# EAGLE board NHK2016mother (EAGLE 6.2)
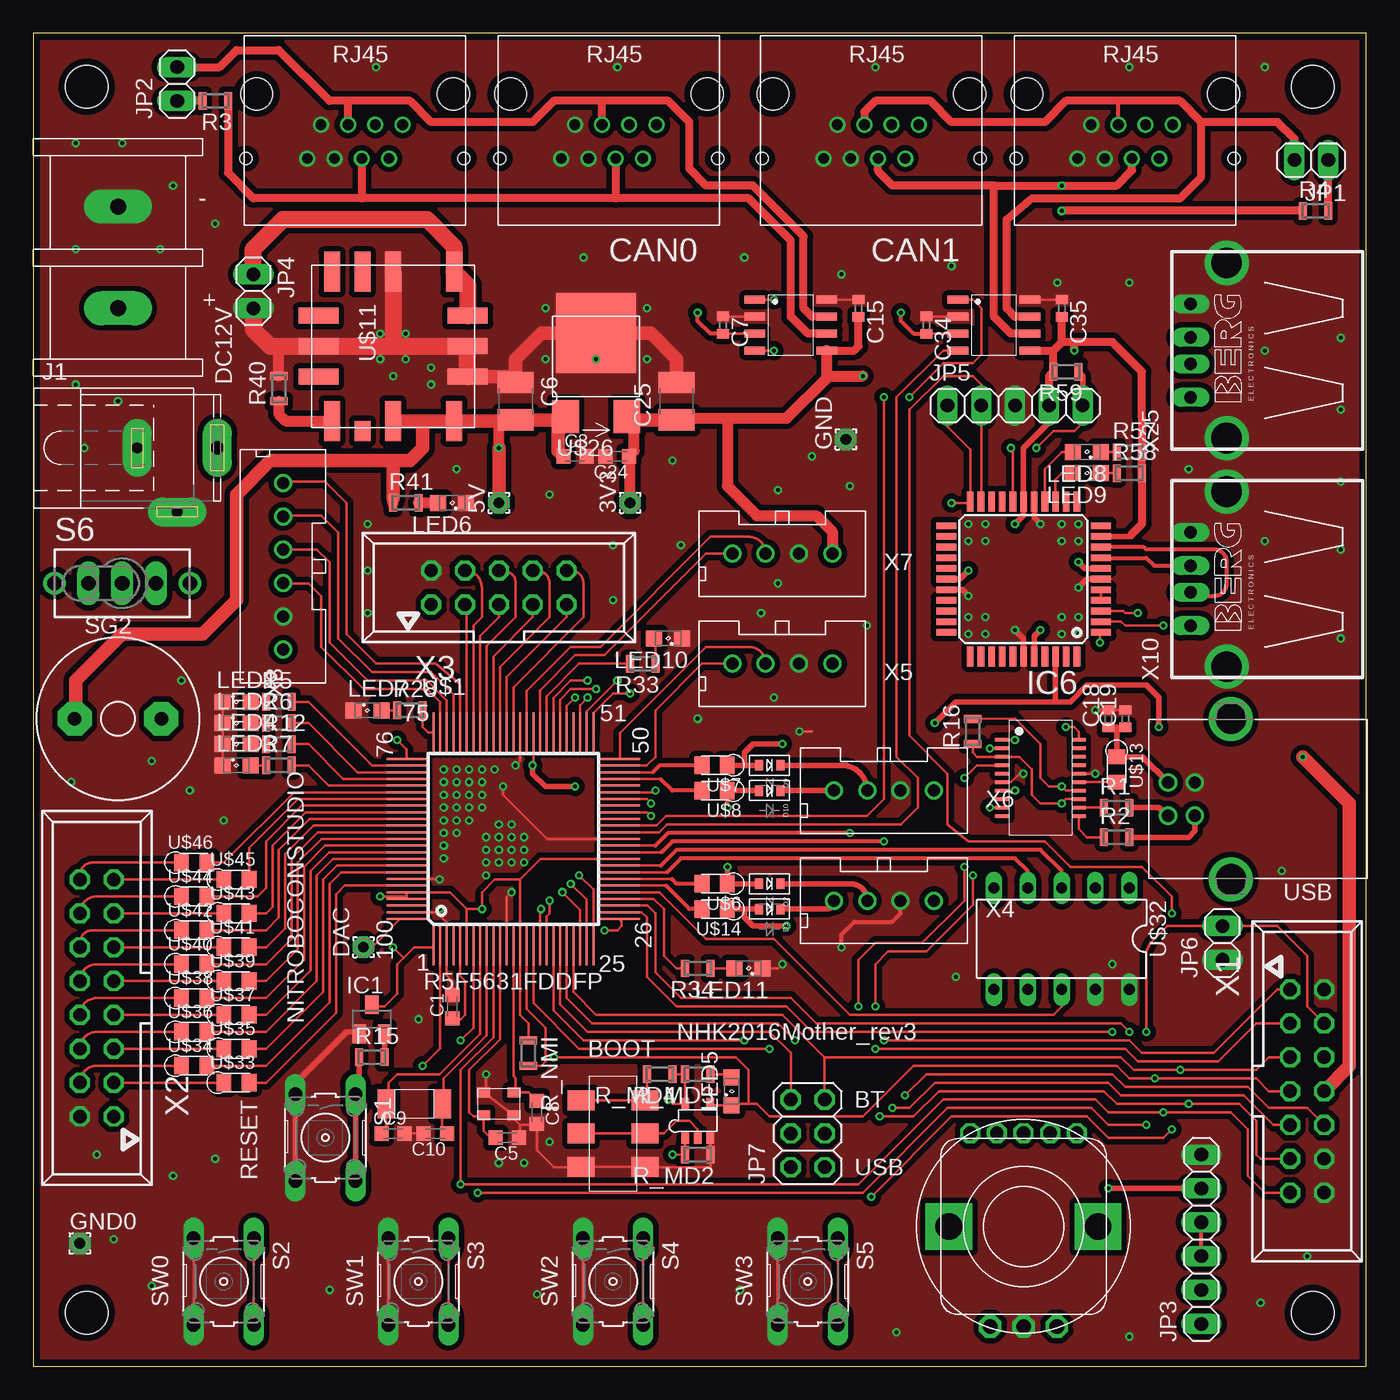
[diagram p1: board, top side]
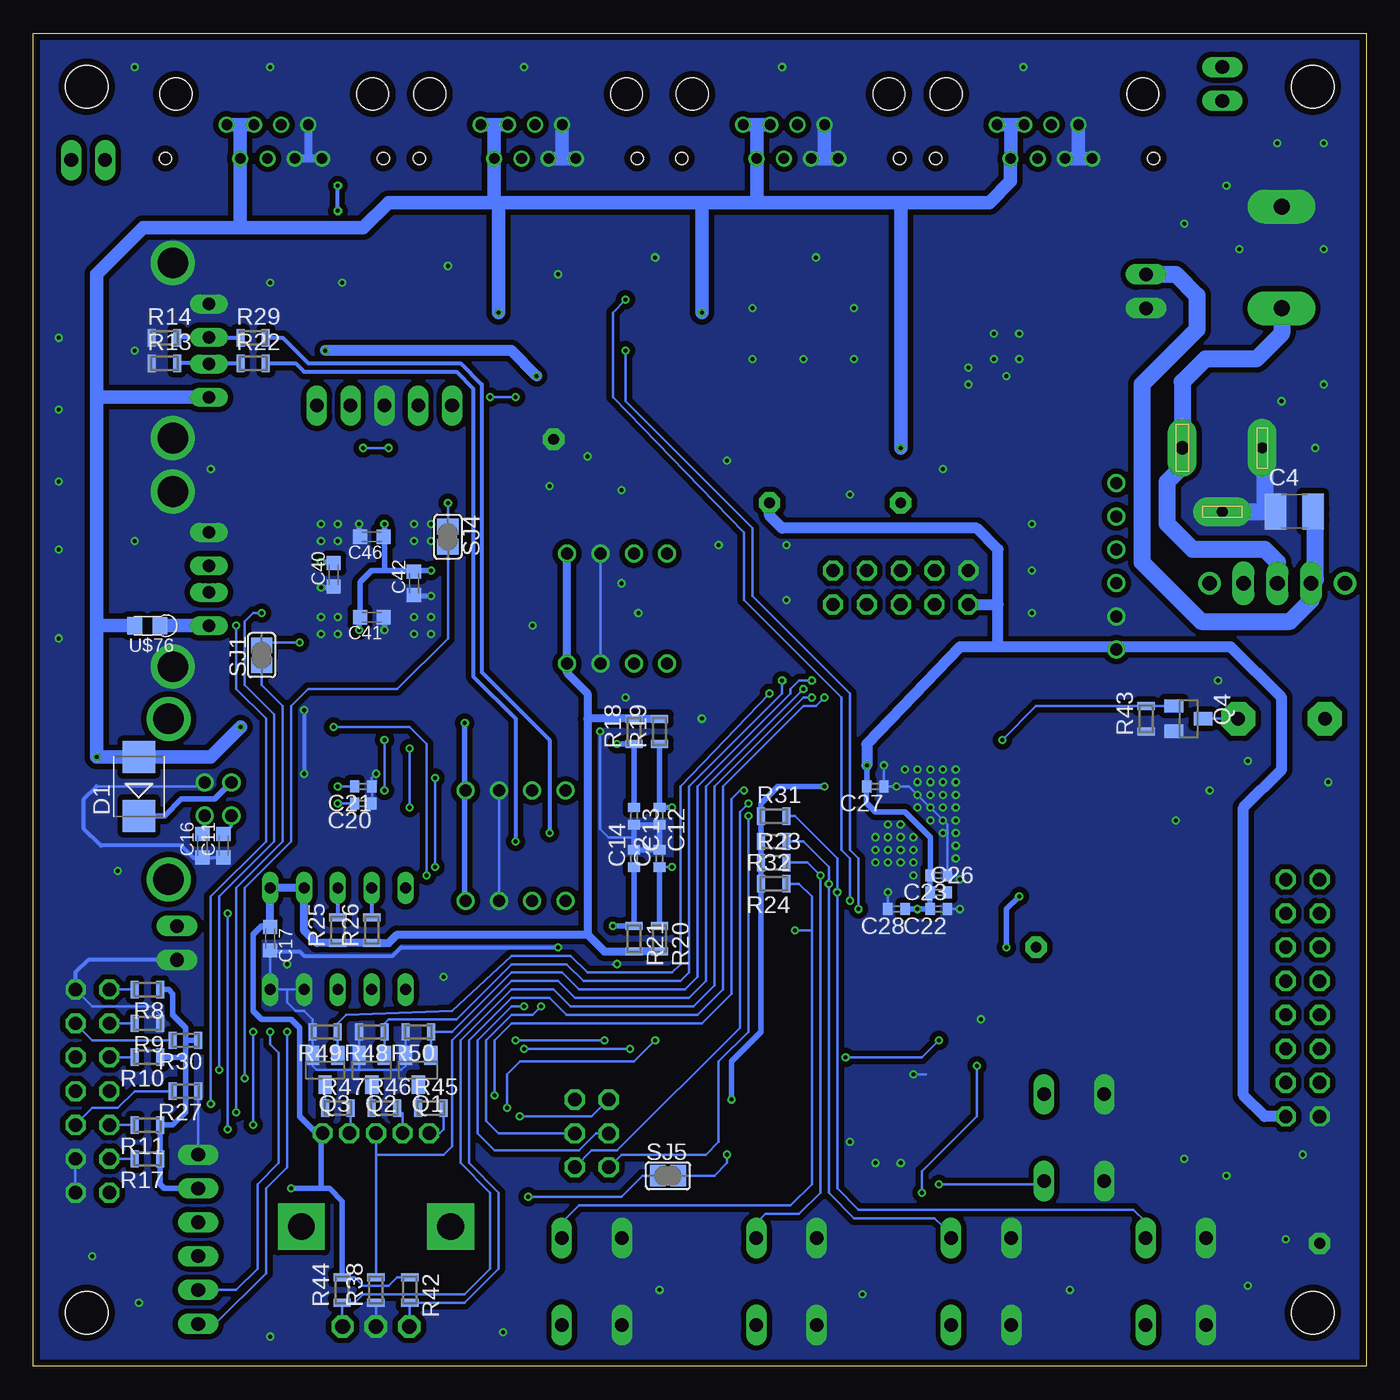
[diagram p2: board, bottom side, seen from below]

Size 100 x 100 mm. Coordinates in mm from the lower left corner, seen from the top.
Outline: 0,0 100,0 100,100 0,100 0,0
Copper layers (1*16): Top 0.035mm / dielectric 1.6mm / Bottom 0.035mm
Design rules "default": minimum track width 6mil, minimum drill 12mil, track to track 6mil, track to pad 6mil, pad to pad 6mil, via to via 8mil, smd to smd 0mil, copper to edge 20mil, drill to drill 10mil, minimum pad ring 6mil, minimum via ring 6mil, stop-mask expansion 0mil, vias tented up to drill 100mil, thermal gap 10mil
Holes 3.2 mm at 4,96 96,96 4,4 96,4

## Footprints (pad centres in the part's own frame; a part is rotated, then mirrored left to right if it is on the bottom)
1,6/0,8 = drill 0.813 pad 1.6 octagon: 1 0,0
C0603K = smd 1.05 x 1.08: 1 -0.875,0; 2 0.875,0
C0402 = smd 0.7 x 0.9: 1 -0.65,0; 2 0.65,0
C3225 = smd 1.6 x 2.7: 1 -1.4,0; 2 1.4,0
SMB = smd 2.4 x 2.4: A 2.2,0; C -2.2,0
SOD-523 = smd 0.8 x 0.6: A 0,-0.8; K 0,0.8
SOT23B-3 = smd 1 x 1.4: 1 -0.95,-1.1; 2 0.95,-1.1; 3 0,1.1
TQFP44 = smd 1.5 x 0.5: 1 -5.8,4; 2 -5.8,3.2; 3 -5.8,2.4; 4 -5.8,1.6; 5 -5.8,0.8; 6 -5.8,0; 7 -5.8,-0.8; 8 -5.8,-1.6; 9 -5.8,-2.4; 10 -5.8,-3.2; 11 -5.8,-4; 23 5.8,-4; 24 5.8,-3.2; 25 5.8,-2.4; 26 5.8,-1.6; 27 5.8,-0.8; 28 5.8,0; 29 5.8,0.8; 30 5.8,1.6; 31 5.8,2.4; 32 5.8,3.2; 33 5.8,4 | smd 0.5 x 1.5: 12 -4,-5.8; 13 -3.2,-5.8; 14 -2.4,-5.8; 15 -1.6,-5.8; 16 -0.8,-5.8; 17 0,-5.8; 18 0.8,-5.8; 19 1.6,-5.8; 20 2.4,-5.8; 21 3.2,-5.8; 22 4,-5.8; 34 4,5.8; 35 3.2,5.8; 36 2.4,5.8; 37 1.6,5.8; 38 0.8,5.8; 39 0,5.8; 40 -0.8,5.8; 41 -1.6,5.8; 42 -2.4,5.8; 43 -3.2,5.8; 44 -4,5.8
SPC4078 = drill 0.8 pad 2.184 long: 1 -3,0; 2 0,-4.8 | drill 1 pad 2.184 long: 3 3,0
1X02 = drill 1.016 long: 1 -1.27,0; 2 1.27,0
1X06 = drill 1.016 long: 1 -6.35,0; 2 -3.81,0; 3 -1.27,0; 4 1.27,0; 5 3.81,0; 6 6.35,0
1X05 = drill 1.016 long: 1 -5.08,0; 2 -2.54,0; 3 0,0; 4 2.54,0; 5 5.08,0
2X03 = drill 1.016 octagon: 1 -2.54,-1.27; 2 -2.54,1.27; 3 0,-1.27; 4 0,1.27; 5 2.54,-1.27; 6 2.54,1.27
SML0805 = smd 1.2 x 1.2: A 1.05,0; C -1.05,0
SOT23 = smd 1 x 1.4: 1 -0.95,-1.1; 2 0.95,-1.1; 3 0,1.1
MINI_MELF-0102W = smd 0.6 x 1.3: 1 -0.95,0; 2 0.95,0
B3F-10XX = drill 1.016 long: 1 -3.251,2.261; 2 3.251,2.261; 3 -3.251,-2.261; 4 3.251,-2.261
TL3XYO = drill 1.1 pad 1.422 long: 1 -2.54,0; 2 0,0; 3 2.54,0 | drill 1.1 pad 1.676: M1 -5.08,0; M2 5.08,0
AL60P = drill 1.016 pad 2.54 octagon: 1 -3.251,0; 2 3.251,0
SJ = smd 1.168 x 1.6: 1 -0.762,0; 2 0.762,0
LQFP100 = smd 0.15 x 3: 1 -6.5,-7.5; 2 -6,-7.5; 3 -5.5,-7.5; 4 -5,-7.5; 5 -4.5,-7.5; 6 -4,-7.5; 7 -3.5,-7.5; 8 -3,-7.5; 9 -2.5,-7.5; 10 -2,-7.5; 11 -1.5,-7.5; 12 -1,-7.5; 13 -0.5,-7.5; 14 0,-7.5; 15 0.5,-7.5; 16 1,-7.5; 17 1.5,-7.5; 18 2,-7.5; 19 2.5,-7.5; 20 3,-7.5; 21 3.5,-7.5; 22 4,-7.5; 23 4.5,-7.5; 24 5,-7.5; 25 5.5,-7.5; 51 5.5,8.5; 52 5,8.5; 53 4.5,8.5; 54 4,8.5; 55 3.5,8.5; 56 3,8.5; 57 2.5,8.5; 58 2,8.5; 59 1.5,8.5; 60 1,8.5; 61 0.5,8.5; 62 0,8.5; 63 -0.5,8.5; 64 -1,8.5; 65 -1.5,8.5; 66 -2,8.5; 67 -2.5,8.5; 68 -3,8.5; 69 -3.5,8.5; 70 -4,8.5; 71 -4.5,8.5; 72 -5,8.5; 73 -5.5,8.5; 74 -6,8.5; 75 -6.5,8.5 | smd 3 x 0.15: 26 7.5,-5.5; 27 7.5,-5; 28 7.5,-4.5; 29 7.5,-4; 30 7.5,-3.5; 31 7.5,-3; 32 7.5,-2.5; 33 7.5,-2; 34 7.5,-1.5; 35 7.5,-1; 36 7.5,-0.5; 37 7.5,0; 38 7.5,0.5; 39 7.5,1; 40 7.5,1.5; 41 7.5,2; 42 7.5,2.5; 43 7.5,3; 44 7.5,3.5; 45 7.5,4; 46 7.5,4.5; 47 7.5,5; 48 7.5,5.5; 49 7.5,6; 50 7.5,6.5; 76 -8.5,6.5; 77 -8.5,6; 78 -8.5,5.5; 79 -8.5,5; 80 -8.5,4.5; 81 -8.5,4; 82 -8.5,3.5; 83 -8.5,3; 84 -8.5,2.5; 85 -8.5,2; 86 -8.5,1.5; 87 -8.5,1; 88 -8.5,0.5; 89 -8.5,0; 90 -8.5,-0.5; 91 -8.5,-1; 92 -8.5,-1.5; 93 -8.5,-2; 94 -8.5,-2.5; 95 -8.5,-3; 96 -8.5,-3.5; 97 -8.5,-4; 98 -8.5,-4.5; 99 -8.5,-5; 100 -8.5,-5.5
SSOP20 = smd 0.254 x 1.041: 1 -2.857,-2.883; 2 -2.223,-2.883; 3 -1.587,-2.883; 4 -0.953,-2.883; 5 -0.318,-2.883; 6 0.318,-2.883; 7 0.953,-2.883; 8 1.587,-2.883; 9 2.223,-2.883; 10 2.857,-2.883; 11 2.857,2.883; 12 2.223,2.883; 13 1.587,2.883; 14 0.953,2.883; 15 0.318,2.883; 16 -0.318,2.883; 17 -0.953,2.883; 18 -1.587,2.883; 19 -2.223,2.883; 20 -2.857,2.883
MCP2562 = smd 1.55 x 0.6: 1 -2.7,2.54; 2 -2.7,1.27; 3 -2.7,0; 4 -2.7,-1.27; 5 2.7,-1.27; 6 2.7,0; 7 2.7,1.27; 8 2.7,2.54
RJ45 = drill 0.8: P$1 -3.57,-0.44; P$2 -2.55,2.1; P$3 -1.53,-0.44; P$4 -0.51,2.1; P$5 0.51,-0.44; P$6 1.53,2.1; P$7 2.55,-0.44; P$8 3.57,2.1 | hole 2.4: -7.375,-2.74; 7.375,-2.74 | hole 0.9: -8.175,2.1; 8.175,2.1
2012 = smd 1.1 x 1.3: 1 -0.95,0; 2 0.95,0
TERMINAL = drill 1.2 pad 2.54 long: P$1 -3.81,0; P$2 3.81,0
OKL_T6_W12 = smd 1.2 x 3: GND@0 0,-5.6; GND@1 2.29,5.6; GND@2 0,5.6; NC@1 -2.29,-5.6; NC@2 2.29,-5.6; VIN@0 -2.29,5.6 | smd 3 x 1.2: NC@0 -5.6,-4.58; ON/OFF -5.6,0; PGOOD -5.6,-2.29; SENSE 5.6,0; TRIM 5.6,-4.58; VIN@1 -5.6,4.58; VOUT 5.6,4.58 | smd 1.5 x 1.2: NC@3 6.35,-2.29
FC-255 = smd 1.3 x 2.2: 1 -2.1,0; 2 2.1,0
TO-252-3-L1 = smd 2 x 2.5: 1 -2.3,-4; 3 2.3,-4 | smd 6 x 6: 2 0,2.25
MPU9150 = drill 0.813 long: 1 -5.08,-3.81; 2 -2.54,-3.81; 3 0,-3.81; 4 2.54,-3.81; 5 5.08,-3.81; 6 5.08,3.81; 7 2.54,3.81; 8 0,3.81; 9 -2.54,3.81; 10 -5.08,3.81
EC12PLRGBSDVBF = drill 1 pad 1.422 octagon: 1 -4,7; 2 -2,7; 3 0,7; 4 2,7; 5 4,7 | drill 1.1 pad 1.676 octagon: 6 2.5,-7.5; 7 0,-7.5; 8 -2.5,-7.5 | drill 2 pad 3.5 square: P$9 -5.6,0; P$10 5.6,0
FA238V = smd 0.95 x 0.75: 1 -1.15,-0.85; 2 1.15,-0.85; 3 1.15,0.85; 4 -1.15,0.85
SOT23-5 = smd 0.57 x 0.95: 1 -0.95,-1.25; 2 0,-1.25; 3 0.95,-1.25; 4 0.95,1.25; 5 -0.95,1.25
SSSS2 = smd 1.5 x 2: 1 -2.5,2.4; 2 0,2.4; 3 2.5,2.4; 4 -2.5,-2.4; 5 0,-2.4; 6 2.5,-2.4
85-32004-10X = drill 0.92 pad 1.27: 1 4.71,-1.25; 2 4.71,1.25; 3 2.71,1.25; 4 2.71,-1.25 | drill 2.3 pad 3: M1 0,6.02; M2 0,-6.02
057-014-1 = drill 1 octagon: 1 -7.62,-1.27; 2 -7.62,1.27; 3 -5.08,-1.27; 4 -5.08,1.27; 5 -2.54,-1.27; 6 -2.54,1.27; 7 0,-1.27; 8 0,1.27; 9 2.54,-1.27; 10 2.54,1.27; 11 5.08,-1.27; 12 5.08,1.27; 13 7.62,-1.27; 14 7.62,1.27
057-016-1 = drill 1 octagon: 1 -8.89,-1.27; 2 -8.89,1.27; 3 -6.35,-1.27; 4 -6.35,1.27; 5 -3.81,-1.27; 6 -3.81,1.27; 7 -1.27,-1.27; 8 -1.27,1.27; 9 1.27,-1.27; 10 1.27,1.27; 11 3.81,-1.27; 12 3.81,1.27; 13 6.35,-1.27; 14 6.35,1.27; 15 8.89,-1.27; 16 8.89,1.27
057-010-1 = drill 1 octagon: 1 -5.08,-1.27; 2 -5.08,1.27; 3 -2.54,-1.27; 4 -2.54,1.27; 5 0,-1.27; 6 0,1.27; 7 2.54,-1.27; 8 2.54,1.27; 9 5.08,-1.27; 10 5.08,1.27
XA-4P = drill 0.9: 1 -3.75,0; 2 -1.25,0; 3 1.25,0; 4 3.75,0
XA-6P = drill 0.9: 1 -6.25,0; 2 -3.75,0; 3 -1.25,0; 4 1.25,0; 5 3.75,0; 6 6.25,0
PN87520-S = drill 0.95 long: 1 -3.5,2.71; 2 -1,2.71; 3 1,2.71; 4 3.5,2.71 | drill 2.3 pad 2.9: S1 -6.57,0; S2 6.57,0

## Placement (x,y rotation side)
3V3  [1,6/0,8]  44.77,64.77 90 top
5V  [1,6/0,8]  34.92,64.77 90 top
C1  0.1uF  [C0603K]  31.43,26.99 90 top
C2  0.01u  [C0402]  53.02,38.1 90 bottom
C3  0.1uF  [C0603K]  40.64,68.26 0 top
C4  47u  [C3225]  5.4,64.14 0 bottom
C5  22p  [C0603K]  35.56,17.14 180 top
C6  47u  [C3225]  36.2,72.39 270 top
C7  0.1u  [C0402]  51.75,78.11 270 top
C8  22p  [C0603K]  37.78,19.05 270 top
C9  15p  [C0603K]  26.99,17.46 0 top
C10  15p  [C0603K]  30.16,17.46 180 top
C11  47p  [C0603K]  85.72,39.05 90 bottom
C12  0.01u  [C0402]  53.02,41.27 270 bottom
C13  0.01u  [C0402]  54.93,41.27 270 bottom
C14  0.01u  [C0402]  54.93,38.1 90 bottom
C15  0.1u  [C0402]  61.91,79.38 270 top
C16  47p  [C0603K]  87.31,39.05 90 bottom
C17  0.1uF  [C0603K]  82.23,32.07 270 bottom
C18  10u  [C0402]  80.64,48.58 90 top
C19  0.1u  [C0402]  81.92,48.58 90 top
C20  0.1u  [C0402]  75.25,42.23 180 bottom
C21  0.1u  [C0402]  75.25,43.5 180 bottom
C22  0.1u  [C0402]  32.07,34.29 180 bottom
C23  0.1u  [C0402]  32.07,36.83 180 bottom
C24  0.1uF  [C0603K]  43.81,68.26 180 top
C25  47u  [C3225]  48.26,72.39 90 top
C26  0.1u  [C0402]  32.07,35.56 0 bottom
C27  0.1u  [C0402]  36.83,43.5 180 bottom
C28  0.1u  [C0402]  35.24,34.29 180 bottom
C34  0.1u  [C0402]  66.99,78.11 270 top
C35  0.1u  [C0402]  77.15,79.38 270 top
C40  10u  [C0603K]  77.47,59.37 90 bottom
C41  0.1u  [C0603K]  74.61,56.2 180 bottom
C42  0.1u  [C0603K]  71.44,58.74 90 bottom
C46  0.1u  [C0603K]  74.61,62.23 180 bottom
D1  ES2D  [SMB]  92.08,43.5 90 bottom
D2  [SOD-523]  55.24,36.2 270 top
D3  [SOD-523]  55.24,34.29 270 top
D9  [SOD-523]  55.24,45.09 270 top
D10  [SOD-523]  55.24,43.18 270 top
DAC  DAC  [1,6/0,8]  24.77,31.43 90 top
GND  [1,6/0,8]  60.96,69.53 90 top
GND0  [1,6/0,8]  3.49,9.21 0 top
IC1  [SOT23B-3]  25.4,26.04 0 top
IC6  PIC24FJ64GA004  [TQFP44]  74.3,59.05 180 top
J1  [SPC4078]  10.79,68.9 0 top
JP1  [1X02]  95.89,90.49 180 top
JP2  [1X02]  10.79,96.2 90 top
JP3  [1X06]  87.63,9.53 90 top
JP4  [1X02]  16.51,80.64 270 top
JP5  [1X05]  73.66,72.07 0 top
JP6  [1X02]  89.22,31.75 90 top
JP7  [2X03]  58.1,17.46 90 top
LED1  [SML0805]  15.24,49.85 0 top
LED2  [SML0805]  15.24,48.26 0 top
LED3  [SML0805]  15.24,45.09 0 top
LED4  [SML0805]  15.24,46.67 0 top
LED5  [SML0805]  52.39,20.64 90 top
LED6  [SML0805]  31.43,64.77 180 top
LED7  [SML0805]  25.08,49.21 0 top
LED8  [SML0805]  79.06,68.58 180 top
LED9  [SML0805]  79.06,66.99 180 top
LED10  [SML0805]  47.62,54.61 180 top
LED11  [SML0805]  53.66,29.84 180 top
Q1  [SOT23]  71.12,22.23 180 bottom
Q2  [SOT23]  74.61,22.23 180 bottom
Q3  [SOT23]  78.11,22.23 180 bottom
Q4  [SOT23]  13.34,48.58 270 bottom
R1  27  [MINI_MELF-0102W]  81.28,41.91 0 top
R2  27  [MINI_MELF-0102W]  81.28,39.69 0 top
R3  120  [MINI_MELF-0102W]  13.65,94.93 180 top
R4  120  [MINI_MELF-0102W]  96.2,86.68 0 top
R5  [MINI_MELF-0102W]  18.41,49.85 0 top
R6  [MINI_MELF-0102W]  18.41,48.26 0 top
R7  [MINI_MELF-0102W]  18.41,45.09 0 top
R8  10k  [MINI_MELF-0102W]  91.44,28.26 180 bottom
R9  10k  [MINI_MELF-0102W]  91.44,25.72 180 bottom
R10  10k  [MINI_MELF-0102W]  91.44,23.18 180 bottom
R11  10k  [MINI_MELF-0102W]  91.44,18.1 180 bottom
R12  [MINI_MELF-0102W]  18.41,46.67 0 top
R13  15k  [MINI_MELF-0102W]  90.17,75.25 0 bottom
R14  15k  [MINI_MELF-0102W]  90.17,77.15 0 bottom
R15  [MINI_MELF-0102W]  25.4,23.18 0 top
R16  10k  [MINI_MELF-0102W]  70.48,47.62 90 top
R17  10k  [MINI_MELF-0102W]  91.44,15.56 180 bottom
R18  200  [MINI_MELF-0102W]  54.93,47.62 90 bottom
R19  200  [MINI_MELF-0102W]  53.02,47.62 90 bottom
R20  200  [MINI_MELF-0102W]  53.02,32.07 270 bottom
R21  200  [MINI_MELF-0102W]  54.93,32.07 270 bottom
R22  22  [MINI_MELF-0102W]  83.5,75.25 0 bottom
R23  10k  [MINI_MELF-0102W]  44.45,37.78 0 bottom
R24  10k  [MINI_MELF-0102W]  44.45,36.2 180 bottom
R25  1k  [MINI_MELF-0102W]  77.15,32.7 90 bottom
R26  1k  [MINI_MELF-0102W]  74.61,32.7 90 bottom
R27  10k  [MINI_MELF-0102W]  88.58,20.64 180 bottom
R28  [MINI_MELF-0102W]  28.26,49.21 0 top
R29  22  [MINI_MELF-0102W]  83.5,77.15 0 bottom
R30  10k  [MINI_MELF-0102W]  88.58,24.45 180 bottom
R31  10k  [MINI_MELF-0102W]  44.45,41.27 0 bottom
R32  10k  [MINI_MELF-0102W]  44.45,39.37 180 bottom
R33  [MINI_MELF-0102W]  45.72,52.7 180 top
R34  [MINI_MELF-0102W]  49.85,29.84 180 top
R38  [MINI_MELF-0102W]  74.3,5.71 90 bottom
R40  1.33k  [MINI_MELF-0102W]  18.41,73.34 90 top
R41  120  [MINI_MELF-0102W]  27.94,64.77 0 top
R42  [MINI_MELF-0102W]  71.75,5.71 270 bottom
R43  10k  [MINI_MELF-0102W]  16.51,48.58 90 bottom
R44  [MINI_MELF-0102W]  76.83,5.71 90 bottom
R45  [MINI_MELF-0102W]  70.17,19.37 0 bottom
R46  [MINI_MELF-0102W]  73.66,19.37 0 bottom
R47  [MINI_MELF-0102W]  77.15,19.37 0 bottom
R48  10k  [MINI_MELF-0102W]  74.61,25.08 180 bottom
R49  10k  [MINI_MELF-0102W]  78.11,25.08 180 bottom
R50  10k  [MINI_MELF-0102W]  71.12,25.08 180 bottom
R57  1k  [MINI_MELF-0102W]  82.23,68.58 0 top
R58  1k  [MINI_MELF-0102W]  82.23,66.99 0 top
R59  10k  [MINI_MELF-0102W]  77.47,74.61 180 top
R_MD2  [MINI_MELF-0102W]  49.85,15.88 180 top
R_MD3  [MINI_MELF-0102W]  49.85,21.91 180 top
R_MD4  [MINI_MELF-0102W]  46.99,21.91 180 top
R_NMI  10k  [MINI_MELF-0102W]  37.15,23.5 270 top
S1  [B3F-10XX]  21.91,17.14 270 top
S2  [B3F-10XX]  14.29,6.35 270 top
S3  [B3F-10XX]  28.89,6.35 270 top
S4  [B3F-10XX]  43.5,6.35 270 top
S5  [B3F-10XX]  58.1,6.35 270 top
S6  TL32YO  [TL3XYO]  6.67,58.74 0 top
SG2  AL60P  [AL60P]  6.35,48.58 0 top
SJ1  [SJ]  82.87,53.34 90 bottom
SJ4  [SJ]  68.9,62.23 270 bottom
SJ5  [SJ]  52.39,14.29 0 bottom
U$1  R5F5631FDDFP  [LQFP100]  36.51,39.05 0 top
U$2  FT231X  [SSOP20]  75.56,44.13 270 top
U$3  MCP2562  [MCP2562]  72.07,77.47 0 top
U$4  RJ45  [RJ45]  62.87,92.71 180 top
U$5  RJ45  [RJ45]  81.92,92.71 180 top
U$6  FB1.25MM 330  [2012]  51.12,36.2 180 top
U$7  FB1.25MM 330  [2012]  51.12,45.09 180 top
U$8  FB1.25MM 330  [2012]  51.12,43.18 180 top
U$9  RJ45  [RJ45]  24.13,92.71 180 top
U$10  TERMINAL  [TERMINAL]  6.35,83.19 90 top
U$11  OKL_T6_W12  [OKL_T6_W12]  26.99,76.52 270 top
U$12  FC-255  [FC-255]  28.57,19.68 0 top
U$13  FB1.25MM  [2012]  81.28,44.77 270 top
U$14  FB1.25MM 330  [2012]  51.12,34.29 180 top
U$17  MCP2562  [MCP2562]  56.83,77.47 0 top
U$26  NJM2845DL1  [TO-252-3-L1]  42.23,75.25 0 top
U$27  RJ45  [RJ45]  43.18,92.71 180 top
U$32  MPU9150  [MPU9150]  77.15,32.07 180 top
U$33  FB1.25MM  [2012]  15.24,21.27 0 top
U$34  FB1.25MM  [2012]  12.06,22.54 0 top
U$35  FB1.25MM  [2012]  15.24,23.81 0 top
U$36  FB1.25MM  [2012]  12.06,25.08 0 top
U$37  FB1.25MM  [2012]  15.24,26.35 0 top
U$38  FB1.25MM  [2012]  12.06,27.62 0 top
U$39  FB1.25MM  [2012]  15.24,28.89 0 top
U$40  FB1.25MM  [2012]  12.06,30.16 0 top
U$41  FB1.25MM  [2012]  15.24,31.43 0 top
U$42  FB1.25MM  [2012]  12.06,32.7 0 top
U$43  FB1.25MM  [2012]  15.24,33.97 0 top
U$44  FB1.25MM  [2012]  12.06,35.24 0 top
U$45  FB1.25MM  [2012]  15.24,36.51 0 top
U$46  FB1.25MM  [2012]  12.06,37.78 0 top
U$58  EC12PLRGBSDVBF  [EC12PLRGBSDVBF]  74.3,10.48 0 top
U$61  FA238V  [FA238V]  34.92,19.68 180 top
U$68  3STATE  [SOT23-5]  49.85,18.41 0 top
U$76  FB1.25MM  [2012]  91.44,55.56 180 bottom
U$82  SSSS2  [SSSS2]  43.5,17.46 90 top
USB  MINI-USB_4P-85-32004-10X  [85-32004-10X]  89.85,42.55 180 top
X1  057-014-1  [057-014-1]  95.57,20.64 270 top
X2  057-016-1  [057-016-1]  4.76,27.62 90 top
X3  057-010-1  [057-010-1]  34.92,58.42 0 top
X4  XA-4PNORMAL  [XA-4P]  63.82,34.92 0 top
X5  XA-4PNORMAL  [XA-4P]  56.2,52.7 0 top
X6  XA-4PNORMAL  [XA-4P]  63.82,43.18 0 top
X7  XA-4PNORMAL  [XA-4P]  56.2,60.96 0 top
X8  XA-6P  [XA-6P]  18.73,60.01 270 top
X10  PN87520-S  [PN87520-S]  89.53,59.05 90 top
X25  PN87520-S  [PN87520-S]  89.53,76.2 90 top

## Tracks (layer width: path | path; a pad name or v marks a point on that pad's centre or on a via)
+3V3  (via drill 0.3)
  Top 0.2: R_MD4.1 R_MD3.2 48.9,20.95 48.9,20.64 U$68.5 47.96,19.66 v47.62,20 | 37.51,45.13 U$1.60 | R_NMI.1 37.15,25.72 36.51,26.35 U$1.14 36.51,36.51 | U$1.96 U$1.97 27.89,35.24 v26.04,35.24 | U$1.1 29.89,31.43 28.57,31.43 27.78,30.64 | 27.78,30.64 27.3,30.16 27.3,27.94 26.35,26.99 25.55,26.99 25.25,26.99 | v26.99,31.43 27.78,30.64 | 32.51,34.29 v33.66,34.29 33.66,35.56 34.61,36.51 36.51,36.51 | U$1.6 32.51,34.29 | U$1.96 28.01,35.31 27.94,35.24 | 36.51,36.51 38.05,38.05 U$1.35 | 32.51,34.29 31.25,35.55 U$1.96
  Top 0.305: 83.19,71.12 83.18,71.12 | 59.53,74.14 59.69,74.3
  Top 0.406: JP5.4 76.2,70.8 74.3,68.9 IC6.17 74.3,63.82 v73.66,63.18 | v75.56,55.24 75.09,54.77 IC6.40 | v70.17,59.69 69.53,59.05 IC6.28 | R58.2 arc-45 R58.2 | 82.35,62.35 arc-45 82.13,62.26 IC6.10 | 37.51,45.13 v37.47,45.09 37.47,44.45 38.42,43.5 v40.64,43.5 | R59.2 | 25.25,26.99 IC1.3 25.55,26.99 | JP3.5 v80.64,13.34
  Top 0.61: R58.2 R57.2 83.18,71.12 | U$17.5 61.59,76.2 61.91,76.52 C15.2 | U$3.5 76.52,76.2 | 76.52,76.2 77.15,76.83 | 77.15,76.83 C35.2 | R59.2 76.2,74.29 JP5.4 | R58.2 83.19,63.18 82.35,62.35 | R59.2 76.52,76.2 | 83.19,71.12 83.19,74.61 80.96,76.83 78.11,76.83 | 78.11,76.83 77.15,76.83 | v78.11,76.2 78.11,76.83
  Top 0.813: 3V3.1 44.77,67.94 44.69,68.19 C24.1 | 44.77,68.26 C24.1 | C24.1 45.09,68.66 45.09,70.99 | C25.1 48.39,71.12 52.07,71.12 | 52.07,71.12 52.07,66.04 54.29,63.82 58.74,63.82 59.95,62.61 X7.4 | 52.07,71.12 56.52,71.12 59.53,74.14 U$17.5 | 59.69,74.3 v62.23,74.3
  Top 1.016: U$26.3 44.78,70.99 45.09,70.99 C25.1
  Bottom 0.2: 78.74,31.75 | U$58.5 78.42,17.35 | R42.1 72.71,6.67 73.34,6.03 75.25,6.03 75.88,6.67 R44.2 | C41.2 75.56,56.12 | C46.1 73.66,61.99 | C42.2 71.36,59.69 | C27.2 37.47,43.51 | C23.2 32.7,36.84 | R18.2
  Bottom 0.305: C17.1 82.31,33.02
  Bottom 0.406: R30.1 88.58,24.45 | 88.58,24.45 88.58,25.4 89.53,26.35 89.53,27.94 89.85,28.26 R8.1 | 88.58,24.45 88.58,23.18 | 88.58,23.18 88.58,19.05 89.53,18.1 R11.1 R17.1 90.49,13.65 90.17,13.34 JP3.5 | R10.1 88.58,23.18 | R44.2 76.83,12.38 77.79,13.34 78.42,13.34 | 78.42,17.35 78.42,13.34 | 75.56,56.12 v75.56,55.24 | v73.66,63.18 73.66,61.99 73.66,59.69 | 71.36,59.69 v70.17,59.69 | C42.2 arc-45 71.62,59.69 73.66,59.69 | 73.66,59.69 74.61,59.69 75.39,58.91 arc-45 75.49,58.68 C41.2 | 37.47,43.51 v37.47,45.09 | C23.2 C26.1 C22.2 v33.66,34.29 C28.1 | v26.04,35.24 26.99,34.29 v26.99,31.43 | 32.7,36.84 32.7,39.69 34.61,41.59 36.83,41.59 37.48,42.24 C27.2 | v40.64,43.5 44.13,43.5 45.4,42.23 R31.1 R32.2 R23.1 R24.2 45.4,25.09 47.62,22.86 v47.62,20 | 82.31,33.02 82.87,33.02 83.5,32.38 83.5,26.67 82.87,26.04 80.64,26.04 80.01,25.4 80.01,18.73 78.75,17.48 U$58.5 | v80.64,13.34 78.42,13.34
  Bottom 0.61: R19.2 R18.2 | X7.4 X5.4 59.95,52.01 58.42,50.48 58.42,48.58 | C17.1 U$32.1 U$32.2 79.69,32.7 78.74,31.75 | 78.74,31.75 R25.1 R26.1 73.34,31.75 72.7,32.38 58.42,32.38 | R20.2 R21.2 57.15,31.12 58.42,32.38 | 58.42,48.58 58.42,32.38 | R18.2 58.42,48.58
  Bottom 0.813: X8.6 18.95,53.98 | 18.95,53.98 27.62,53.98 | 27.62,53.98 27.62,57.15 | 27.62,57.15 27.62,61.28 29.21,62.87 43.81,62.87 44.77,63.82 3V3.1 | X3.1 27.62,57.15 | 27.62,53.98 30.48,53.98 37.47,46.67 v37.47,45.09 | v62.23,74.3 64.14,76.2 v78.11,76.2 | X2.1 7.62,18.73 9.21,20.32 9.21,41.91 6.35,44.77 6.35,50.16 10.16,53.98 18.95,53.98
AN000
  Top 0.2: U$33.2 17.46,21.27 22.7,26.51 22.7,35.4 23.35,36.05 U$1.95
AN001
  Top 0.2: U$34.2 17.46,22.54 22.23,27.3 22.23,36.2 23.08,37.05 U$1.93
AN002
  Top 0.2: U$35.2 17.46,23.81 21.75,28.1 21.75,36.51 22.79,37.55 U$1.92
AN003
  Top 0.2: U$36.2 17.46,25.08 21.27,28.89 21.27,36.83 22.5,38.05 U$1.91
AN004
  Top 0.2: U$37.2 17.46,26.35 20.8,29.69 20.8,37.15 22.2,38.55 U$1.90
AN005
  Top 0.2: U$38.2 17.46,27.62 20.32,30.48 20.32,37.47 21.91,39.05 U$1.89
AN006
  Top 0.2: U$39.2 17.46,28.89 19.84,31.27 19.84,37.78 21.61,39.55 U$1.88
AN007
  Top 0.2: U$40.2 17.46,30.16 19.37,32.07 19.37,38.1 21.32,40.05 U$1.87
AN008
  Top 0.2: U$41.2 17.46,31.43 18.89,32.86 18.89,38.42 21.03,40.55 U$1.86
AN009
  Top 0.2: U$42.2 17.46,32.7 18.41,33.66 18.41,38.73 20.73,41.05 U$1.85
AN010
  Top 0.2: U$43.2 17.46,33.97 17.94,34.45 17.94,39.05 20.44,41.55 U$1.84
AN011
  Top 0.2: U$44.2 16.83,35.24 17.46,35.88 17.46,39.37 20.14,42.05 U$1.83
AN012
  Top 0.2: U$45.2 16.19,38.89 19.85,42.55 U$1.82
AN013
  Top 0.2: U$46.2 14.29,37.78 19.56,43.05 21.59,43.05 U$1.81
CRX0  (via drill 0.3)
  Top 0.2: U$17.4 v55.56,76.2 | v38.1,34.29 38.01,34.2 U$1.17
  Bottom 0.2: v55.56,76.2 55.56,72.39 46.04,62.87 46.04,57.78 38.73,50.48 38.73,38.73 38.1,38.1 v38.1,34.29
CRX1
  Top 0.2: U$3.4 68.26,76.2 64.77,72.71 64.77,45.72 66.36,44.13 66.36,41.91 65.09,40.64 47.53,40.64 46.94,40.05 U$1.39
CTS-RTS0
  Top 0.305: JP3.3 JP3.4
CTS/RTS
  Top 0.2: IC6.5 IC6.4
CTX0  (via drill 0.3)
  Top 0.2: U$17.1 v55.56,80.01 | v38.73,34.92 38.73,33.97 38.51,33.75 U$1.18
  Bottom 0.2: v55.56,80.01 56.52,79.06 56.52,72.71 46.67,62.55 46.67,57.47 39.37,50.16 39.37,38.73 38.73,38.1 v38.73,34.92
CTX1  (via drill 0.3)
  Top 0.2: v63.82,72.71 63.82,42.55 62.55,41.27 47.48,41.27 46.76,40.55 U$1.40 | v65.72,72.71 68.26,75.25 70.48,75.25 71.12,75.88 71.12,79.38 70.48,80.01 U$3.1
  Bottom 0.2: v63.82,72.71 v65.72,72.71
DM
  Top 0.406: R1.2 84.45,41.91 85.07,41.3 USB.2
  Bottom 0.254: C11.2 85.14,40.51 USB.2
DP
  Top 0.406: R2.2 86.68,39.69 87.14,40.15 USB.3
  Bottom 0.254: C16.2 87.14,40.1 USB.3
EMLE  (via drill 0.3)
  Top 0.2: X1.4 95.57,26.99 95.57,30.8 93.34,33.02 JP6.2 85.09,33.02 83.82,31.75 83.5,31.11 v83.5,25.08 | v83.5,18.1 80.64,18.1 79.38,19.37 68.58,19.37 62.23,13.02 v33.34,13.02 | v29.21,22.54 30.51,23.84 U$1.2
  Bottom 0.2: R30.2 95.57,24.45 X1.4 | v83.5,25.08 v83.5,18.1 | v33.34,13.02 33.34,14.61 29.21,18.73 v29.21,22.54
ENC-A  (via drill 0.3)
  Top 0.2: v40.64,50.16 40.01,49.54 U$1.55
  Bottom 0.2: U$58.8 71.75,3.02 R42.2 67.63,4.76 65.09,7.3 65.09,13.02 67.31,15.24 67.31,24.45 64.14,27.62 61.28,27.62 60.01,26.35 50.16,26.35 48.26,28.26 48.26,43.5 42.23,49.53 41.27,49.53 v40.64,50.16
ENC-B  (via drill 0.3)
  Top 0.2: v41.59,50.16 41.01,49.59 U$1.53
  Bottom 0.2: U$58.6 76.83,3.02 R44.1 75.88,4.76 75.25,5.4 67.63,5.4 65.72,7.3 65.72,13.02 67.94,15.24 67.94,24.45 64.14,28.26 60.96,28.26 59.69,26.99 50.48,26.99 48.9,28.57 48.9,43.5 42.23,50.16 v41.59,50.16
ENC-BLUE  (via drill 0.3)
  Top 0.2: v44.77,50.48 43.5,50.48 42.01,49 U$1.51
  Bottom 0.2: Q3.1 R49.1 77.15,25.72 76.52,26.35 68.58,26.67 64.14,30.8 59.69,30.8 58.42,29.53 52.07,29.53 51.44,30.16 51.44,43.5 v44.77,50.48
ENC-GREEN  (via drill 0.3)
  Top 0.2: v43.81,51.44 41.51,49.13 U$1.52
  Bottom 0.2: Q2.1 R48.1 73.66,25.72 73.34,26.04 68.26,26.04 64.14,30.16 60.01,30.16 58.74,28.89 51.44,28.89 50.8,29.53 50.8,43.5 43.81,50.48 v43.81,51.44
ENC-RED  (via drill 0.3)
  Top 0.2: v41.59,51.44 40.32,51.44 39.01,50.12 U$1.57
  Bottom 0.2: Q1.1 R50.1 68.58,25.08 64.14,29.53 60.33,29.53 59.05,28.26 51.12,28.26 50.16,29.21 50.16,43.5 43.18,50.48 43.18,50.8 42.55,51.44 v41.59,51.44
ENC-SW  (via drill 0.3)
  Top 0.2: v42.23,50.8 40.32,50.8 39.51,49.99 U$1.56
  Bottom 0.2: R38.2 74.3,15.88 | U$58.3 74.3,15.88 | 74.3,15.88 69.22,15.88 68.58,16.51 68.58,24.45 64.14,28.89 60.64,28.89 59.37,27.62 50.8,27.62 49.53,28.89 49.53,43.5 v42.23,50.8
EXTAL
  Top 0.2: C8.1 37.17,20.54 U$61.1 36.2,20.66 36.2,21.59 36.01,21.77 U$1.13
FT231X-RXD  (via drill 0.3)
  Top 0.2: v61.91,26.99 61.91,30.48 63.18,31.75 66.67,31.75 69.85,34.92 v69.85,37.47 | v69.85,44.13 70.8,45.09 U$2.4
  Bottom 0.2: JP7.3 65.09,17.46 66.04,18.41 66.04,24.45 64.14,26.35 62.55,26.35 v61.91,26.99 | v69.85,37.47 v69.85,44.13
FT231X-TXD  (via drill 0.3)
  Top 0.2: v63.18,26.99 63.18,30.16 64.14,31.11 66.99,31.11 70.48,34.61 v70.48,36.83 | v77.47,47.94 78.11,47.94 78.45,47.6 U$2.20
  Bottom 0.2: JP7.4 57.78,17.46 59.05,16.19 65.41,16.19 66.67,17.46 66.67,24.45 64.14,26.99 v63.18,26.99 | v70.48,36.83 70.48,46.67 71.75,47.94 v77.47,47.94
GND  (via drill 0.3)
  Top 0.2: LED3.C LED4.C LED2.C LED1.C | S2.4 S2.3 | S3.4 S3.3 | S4.4 S4.3 | S5.4 S5.3 | 36.51,18.1 37.7,18.1 C8.2 37.78,16.19 39.05,14.92 41.69,14.92 U$82.1 U$82.4 45.94,14.92 50.8,14.92 R_MD2.1 | C5.1 36.51,17.22 36.51,18.1 | 36.51,18.1 36.08,18.54 U$61.4 U$61.2 33.97,20.73 v33.97,21.91 | R_MD2.1 U$68.3 | C9.2 C10.2 | U$2.6 73.34,43.81 73.98,44.45 v74.3,44.45 | U$2.16 v79.69,44.45 | U$17.2 54.12,78.75 C7.1 | C15.1 61.9,80.01 U$17.8 | U$3.2 69.36,78.75 C34.1 | U$3.8 74.79,80.03 C35.1 | v36.2,45.09 36.51,45.4 U$1.62 | U$1.99 30.48,34.05 v30.48,34.29 30.48,33.81 31.01,33.28 U$1.3 31.01,29.31 31.43,28.89 C1.2 | U$1.12 35.51,35.2 v35.88,35.56 | v30.48,36.51 30.44,36.55 U$1.94 | v35.24,43.5 35.24,42.86 38.55,39.55 U$1.38 | C18.2 C19.2 81.92,49.21 | v57.47,47.62 58.42,47.62 | R_MD2.1 | LED11.C 55.88,29.84 v56.2,30.16
  Top 0.305: C18.2 80.63,49.21 v79.69,49.21 | v60.64,31.43 60.64,32.38 61.59,33.34 64.45,33.34 65.07,33.95 X4.3
  Top 0.406: v70.17,57.78 69.7,58.26 IC6.29 | v73.66,55.24 74.3,54.61 IC6.39 | v78.42,58.42 79.06,59.05 IC6.6 | v75.56,63.18 75.09,63.65 IC6.16 | IC1.1 24.3,25.08 23.5,25.08 19.65,21.23 S1.3 S1.4
  Top 0.813: R40.2 18.41,76.52
  Top 1.016: U$11.GND@1 35.76,74.23 C6.1 36.2,75.56 38.13,77.5 U$26.2 46.33,77.5 48.26,75.56 C25.2
  Top 1.27: U$11.GND@1 U$11.GND@2 26.99,76.52 | 26.99,76.52 U$11.GND@0 18.41,76.52 17.78,76.52 16.51,77.79 JP4.2 | U$11.ON/OFF 26.99,76.52
  Bottom 0.2: R9.1 90.49,26.35 91.12,26.99 95.57,26.99 X1.2 | R27.1 JP3.6 | X1.14 X1.12 | C13.2 55.24,40.64 | X6.3 X4.3 | X5.3 X7.3 | Q1.2 R50.2 72.07,22.54 72.39,22.23 75.56,22.23 | R48.2 Q2.2 75.56,22.23 | U$58.7 R38.1 | C17.2 U$32.10 80.96,28.26 | 80.96,28.26 U$32.9 | 80.96,28.26 80.96,27.3 80.33,26.67 79.69,26.67 79.06,26.04 R49.2 Q3.2 79.06,22.54 78.74,22.23 75.56,22.23 | C16.1 C11.1 | C20.1 C21.1 | v74.3,44.45 74.61,44.13 C21.1 | 74.6,43.8 C21.1 | USB.4 87.44,43.5 95.25,43.5 | C42.1 71.36,57.78 | C41.1 73.66,56.12 | C40.1 77.55,58.42 | C46.2 75.56,62.31 | C27.1 36.2,43.51 | 36.2,43.51 v36.2,45.09 | v30.48,36.51 30.8,36.83 C23.1 31.43,36.84 31.43,40.64 34.29,43.5 v35.24,43.5 C27.1 | C22.1 v30.48,34.29 | C28.2 v35.88,35.56 | v33.97,21.91 33.02,21.91 | 36.2,43.51 36.2,43.5 C27.1 | 54.93,39.69 56.83,39.69 57.47,40.32 v57.47,47.62 | v56.2,30.16 56.52,30.16
  Bottom 0.305: U$9.P$7 | U$27.P$7 | v79.69,49.21 v79.69,44.45 | C11.1 87.23,38.1 87.95,38.1 88.9,39.05 94.93,39.05 96.2,40.32 96.2,42.55 95.25,43.5 | JP6.1 95.89,30.48 96.84,29.53 X1.2 | C17.2 81.52,31.11 80.01,31.11 79.69,30.8 73.03,30.8 72.39,31.43 v60.64,31.43
  Bottom 0.406: 71.36,57.78 v70.17,57.78 | 73.66,56.12 v73.66,55.24 | 77.55,58.42 v78.42,58.42 | 75.56,62.31 v75.56,63.18 | C2.2 C14.2 54.93,39.69 C13.2 C12.2 C2.2
  Bottom 0.61: U$5.P$8 79.36,90.61 | 79.36,90.61 U$5.P$6 | U$5.P$7 79.36,90.61
  Bottom 1.016: U$9.P$8 21.59,90.61 | 21.59,90.61 U$9.P$6 | U$9.P$7 21.59,90.61 | U$27.P$8 40.64,90.61 | 40.64,90.61 U$27.P$6 | U$27.P$7 40.64,90.61 | U$4.P$8 60.31,90.61 | 60.31,90.61 U$4.P$6 | U$4.P$7 60.31,90.61
  Bottom 1.27: C4.1 6.83,64.1 7.62,64.1 | 7.62,64.1 J1.2 | J1.1 7.62,68.72 7.62,64.1
  other vias: 26.04,77.47 27.94,77.47 27.94,75.56 26.04,75.56 30.8,42.86 30.8,40.96 30.8,39.05 35.88,39.69 36.83,39.69 35.88,38.73 36.83,38.73 34.92,39.69 34.92,38.73 3.17,83.82 9.53,83.82 10.48,88.58 13.65,85.72 29.84,74.93 29.84,73.66 38.42,79.38 38.42,75.56 41.27,83.19 42.23,75.56 46.04,75.56 46.04,79.38 53.34,83.19 60.64,81.92 68.9,82.55 76.83,81.28 82.23,81.28 86.68,67.31 92.39,61.91 93.66,37.15 95.57,8.26 92.08,4.76 82.23,2.22 64.77,2.54 53.02,5.71 37.78,5.4 22.23,5.71 6.03,9.53 3.17,91.76 6.67,91.76 25.72,97.47 43.81,97.47 63.18,97.47 82.23,97.47 92.39,97.47 92.39,76.2 48.58,61.59 54.61,56.52 55.88,58.74 62.55,55.56 49.85,48.58 55.56,50.16 47.94,67.94 58.42,68.26 61.28,66.04 13.65,15.56 8.89,6.03 10.48,14.29 3.17,73.66 6.35,72.39 26.99,74.3 34.92,15.24 36.83,15.24 38.73,16.83 98.11,77.15 98.11,71.75 98.11,66.36 98.11,61.28 98.11,54.61 2.86,43.81 8.89,45.4 11.75,43.18 11.11,51.44 25.08,56.52 25.08,59.69 25.08,63.18 69.22,29.21 80.96,30.16 55.88,65.72 43.5,61.59 43.5,57.47 3.81,68.9 31.75,67.31 38.73,65.41 14.29,40.96 28.89,26.04 4.76,15.88 30.8,43.81 30.8,41.91 30.8,40.01 30.8,44.77 30.8,38.1 31.75,44.77 31.75,43.81 32.7,44.77 33.66,44.77 34.61,44.77 31.75,42.86 32.7,43.81 31.75,41.91 33.66,43.81 35.88,37.78 36.83,37.78 35.88,40.64 34.92,40.64 34.92,37.78 33.97,37.78 33.97,38.73 33.97,39.69 33.97,36.83 32.7,42.86 31.75,40.96 32.7,41.91 32.7,40.96 33.66,42.86 33.66,41.91 31.75,40.01 70.17,56.2 70.17,54.93 71.44,54.93 71.44,56.2 70.17,63.18 70.17,61.91 71.44,61.91 71.44,63.18 78.42,63.18 78.42,61.91 77.15,61.91 77.15,63.18 78.42,54.93 78.42,56.2 77.15,56.2 77.15,54.93
  pour Top (isolate 0.406, no thermals): 0,100 0,0 100,0 100,100
  pour Bottom (isolate 0.406, no thermals): 0,100 0,0 100,0 100,100
IMU_INT
  Top 0.2: U$32.8 77.15,26.99 76.52,26.35 61.28,26.35 55.56,32.07 50.48,32.07 47,35.55 U$1.30
MD  (via drill 0.3)
  Top 0.2: X1.7 92.71,20.64 91.76,21.59 v84.14,21.59 82.23,21.59 81.28,22.54 66.04,22.54 62.23,18.73 55.24,18.73 54.29,19.68 53.66,19.68 | U$1.7 33.02,25.4 v32.07,24.45 | v39.05,23.18 52.7,23.18 53.66,22.23 53.66,19.68 | U$68.4 50.56,19.59 LED5.C 52.48,19.68 53.66,19.68
  Bottom 0.2: v32.07,24.45 33.34,23.18 v39.05,23.18 | SJ4.2 68.9,54.61 72.71,50.8 79.38,50.8 80.64,49.53 80.64,39.37 84.14,35.88 v84.14,21.59
MISOB
  Top 0.2: X8.1 18.83,66.36 21.91,66.36 23.5,64.77 23.5,54.93 25.72,52.7 30.16,52.7 32.01,51.17 U$1.71
MODE_SW_EN  (via drill 0.3)
  Top 0.2: U$68.1 R_MD2.2 v47.95,15.88 v47.94,15.88
  Bottom 0.2: SJ5.2 48.9,14.29 47.94,15.24 v47.94,15.88
MOSIB
  Top 0.2: X8.2 18.79,63.82 21.59,63.82 22.86,62.55 22.86,54.61 25.4,52.07 29.84,52.07 31.51,50.4 U$1.72
MTCLKA
  Top 0.2: 47.91,36.55 U$1.32
  Top 0.305: U$6.2 48.26,36.2 47.91,36.55
MTCLKA_I  (via drill 0.3)
  Top 0.2: v52.07,37.47 v52.07,37.46 | D2.A 54.61,36.2
  Top 0.406: D2.A U$6.1 v52.07,37.46
  Bottom 0.2: 53.01,37.47 C2.1 53.02,37.47 53.01,37.47 | 53.01,37.47 v52.07,37.47
  Bottom 0.406: R20.1 C2.1
MTCLKB
  Top 0.2: 47.45,36.05 U$1.31
  Top 0.305: U$14.2 49.21,34.29 47.45,36.05
MTCLKB_I  (via drill 0.3)
  Top 0.406: U$14.1 53.34,34.29 | D3.A 53.34,34.29 | 53.34,34.29 53.34,33.66 53.98,33.02 v56.52,33.02
  Bottom 0.2: R21.1
  Bottom 0.406: C14.1 R21.1 v56.52,33.02
MTCLKC
  Top 0.2: 46.46,44.55 U$1.48
  Top 0.305: U$7.2 46.99,45.09 46.46,44.55
MTCLKC_I  (via drill 0.3)
  Top 0.406: D9.A 53.34,45.09 | 53.34,45.09 U$7.1 | v56.2,46.67 53.98,46.67 53.34,46.04 53.34,45.09
  Bottom 0.2: R18.1 55.25,46.67
  Bottom 0.406: C13.1 R18.1 | 55.25,46.67 v56.2,46.67
MTCLKD
  Top 0.2: 47.07,44.05 U$1.47
  Top 0.305: U$8.2 47.94,43.18 47.07,44.05
MTCLKD_I  (via drill 0.3)
  Top 0.2: v52.07,41.91
  Top 0.305: v52.07,41.91 U$8.1
  Top 0.406: D10.A U$8.1
  Bottom 0.2: C12.1 52.7,41.92
  Bottom 0.406: 52.7,41.92 v52.07,41.91 | R19.1 C12.1
MTIOC4A  (via drill 0.3)
  Top 0.2: v27.3,46.99 28.01,46.28 U$1.76
  Bottom 0.2: Q4.1 R43.2 24.77,49.53 v27.3,46.99
N$1
  Top 0.2: U$2.12 R1.1
N$2
  Top 0.2: R_NMI.2 38.1,22.54 38.42,22.86 38.42,25.4 37.01,26.8 U$1.15
N$3
  Top 0.2: R_MD3.1 52.07,21.91 LED5.A
N$4
  Top 0.2: R2.1 79.06,39.69 78.45,40.3 U$2.11
N$5  (via drill 0.3)
  Top 0.2: 72.71,47.02 U$2.1 v73.66,46.99 | U$2.7 v73.66,43.18
  Bottom 0.2: v73.66,43.18 v73.66,46.99
N$6  (via drill 0.3)
  Top 0.2: U$2.2 v71.75,46.35 | v71.75,41.91 U$2.9
  Bottom 0.2: v71.75,46.35 v71.75,41.91
N$7
  Top 0.61: R3.2 JP2.1
N$8
  Top 0.305: U$5.P$5 81.41,94.93
  Top 0.61: U$3.7 73.66,78.74 73.03,79.38 73.03,86.04 74.93,87.63 86.04,87.63 87.63,89.22 87.63,93.34 | 87.63,93.34 86.04,94.93 81.41,94.93 77.47,94.93 75.88,93.34 68.9,93.34 67.31,94.93 63.18,94.93 62.35,94.11 U$4.P$5 | JP1.2 94.61,92.08 93.34,93.34 87.63,93.34
N$9  (via drill 0.3)
  Top 0.61: U$3.6 73.34,77.47 72.07,78.74 72.07,88.58 | 72.07,88.58 64.45,88.58 63.38,89.66 U$4.P$4 | 72.07,88.58 v77.15,88.58 81.28,88.58 82.42,89.73 U$5.P$4 | R4.1 v77.15,86.68
  Bottom 0.305: v77.15,86.68 v77.15,88.58
N$10
  Top 0.305: JP1.1
  Top 0.61: R4.2 JP1.1
N$11
  Top 0.2: R5.2 20.64,49.85 25.43,45.05 U$1.77
N$12
  Top 0.2: R6.2 20.64,48.26 24.34,44.55 U$1.78
N$13
  Top 0.2: R7.2 20.64,45.09 22.17,43.55 U$1.80
N$14
  Top 0.61: U$17.7 58.42,78.74 57.78,79.38 57.78,84.77 53.98,88.58 50.48,88.58 49.21,89.85 49.21,93.34 47.62,94.93 42.67,94.93 | 42.67,94.93 39.05,94.93 37.47,93.34 29.84,93.34 28.26,94.93 23.62,94.93 | 23.62,94.93 22.23,94.93 18.41,98.74 15.24,98.74 13.97,97.47 JP2.2 | U$27.P$5 42.67,94.93 | U$9.P$5 23.62,94.93
N$15
  Top 0.305: 14.6,89.53 14.61,89.53
  Top 0.61: U$17.6 58.1,77.47 56.83,78.74 56.83,84.45 53.66,87.63 43.69,87.63 | 43.69,87.63 24.64,87.63 | 24.64,87.63 16.51,87.63 14.61,89.53 | U$27.P$4 43.69,87.63 | R3.1 14.6,89.53 | U$9.P$4 24.64,87.63
N$16
  Top 0.2: LED1.A R5.1
N$17
  Top 0.406: IC1.2 R15.2
N$18
  Top 0.2: LED2.A R6.1
N$19
  Top 0.2: LED3.A R7.1
N$20
  Top 0.2: R12.2 20.64,46.67 23.26,44.05 U$1.79
N$21
  Top 0.2: LED4.A R12.1
N$22
  Top 0.2: LED7.A R28.1
N$23
  Top 0.2: R28.2 29.21,47.94 29.6,47.55 U$1.75
N$24
  Top 0.2: DAC.1 25.4,31.43 27.52,33.55 U$1.100
N$25
  Top 0.406: D10.K X6.1
N$26
  Top 0.406: D9.K 60.66,45.09 | 60.66,45.09 60.64,45.09 60.66,45.09 | 60.66,45.09 arc-90 X6.2
N$27
  Top 0.406: D2.K 61.3,36.2 | 61.3,36.2 61.28,36.2 61.3,36.2 | 61.3,36.2 arc-90 X4.2
N$28
  Top 0.406: D3.K 59.43,34.29 | 59.43,34.29 59.37,34.29 59.43,34.29 | 59.43,34.29 arc90 X4.1
N$29
  Top 0.813: LED6.A R41.2
N$30
  Top 0.813: R40.1 18.41,71.44 18.93,70.92 U$11.TRIM
N$31
  Top 0.2: U$2.15 U$13.2
N$32
  Top 0.2: C1.1 31.51,26.04 32.07,26.04 32.38,26.35 32.38,28.89 32.01,29.27 U$1.5
N$33  (via drill 0.3)
  Top 0.2: U$2.13 77.47,42.55 v77.15,42.23 75.56,42.23 74.93,42.86 74.93,44.77 73.98,45.72 U$2.3 70.8,45.72 70.48,46.04 R16.1
  Bottom 0.2: v77.15,42.23 C20.2
N$34  (via drill 0.3)
  Top 0.2: U$2.14 77.47,43.18 v77.15,43.5 76.2,43.5 75.56,44.13 75.56,46.67 74.3,47.94 73.66,48.58 R16.2
  Bottom 0.2: v77.15,43.5 C21.2
N$35
  Top 0.406: USB.1 83.22,45.72 U$13.1 81.28,47.94 | 81.28,47.94 81.27,47.93 C18.1 | C19.1 81.3,47.93 arc-90 81.28,47.94
  Bottom 0.406: USB.1 86.39,42.55 88.9,42.55 90.15,41.3 D1.C
N$36
  Bottom 0.2: 86.78,77.15 X25.3 86.87,77.15
  Bottom 0.305: 86.78,77.15 R29.1 | 86.87,77.15 R14.2
N$37
  Bottom 0.2: 86.78,75.25 X25.2 86.87,75.25
  Bottom 0.305: 86.78,75.25 R22.1 | 86.87,75.25 R13.2
N$38
  Bottom 0.406: U$76.1
  Bottom 1.016: U$76.1 X10.1
N$39
  Top 0.2: R33.1 46.67,54.52 LED10.A
N$40
  Top 0.2: R34.1 LED11.A
N$41
  Top 0.2: R33.2 40.96,52.7 38.51,50.26 U$1.58
N$42
  Top 0.2: R34.2 48.26,29.84 47.31,30.8 47.31,34.29 46.55,35.05 U$1.29
N$59
  Top 0.2: X2.3 U$33.1
N$60
  Top 0.2: X2.4 arc-90 4.76,22.54 U$34.1
N$61
  Top 0.2: X2.5 U$35.1
N$62
  Top 0.2: X2.6 arc-90 4.76,25.08 U$36.1
N$63
  Top 0.2: X2.7 U$37.1
N$64
  Top 0.2: X2.8 arc-90 4.76,27.62 U$38.1
N$65
  Top 0.2: X2.9 U$39.1
N$66
  Top 0.2: X2.10 arc-90 4.76,30.16 U$40.1
N$67
  Top 0.2: X2.11 U$41.1
N$68
  Top 0.2: X2.12 3.49,31.75 arc-90 4.45,32.7 4.76,32.7 U$42.1
N$69
  Top 0.2: X2.13 U$43.1
N$70
  Top 0.2: X2.14 arc-90 4.76,35.24 U$44.1
N$71
  Top 0.2: X2.15 U$45.1
N$72
  Top 0.2: X2.16 3.49,36.83 arc-90 4.45,37.78 4.76,37.78 U$46.1
N$77
  Bottom 0.2: Q4.3 SG2.2
N$86
  Bottom 0.2: R45.1 Q1.3
N$90
  Top 0.2: U$82.2 U$82.5 47.31,17.46 48.26,18.41 49.21,18.41 49.85,17.78 U$68.2
N$91
  Bottom 0.2: U$58.1 70.28,17.46 69.53,17.46 69.22,17.78 R45.2
N$93
  Bottom 0.2: R46.2 72.3,18.95 U$58.2
N$94
  Bottom 0.2: U$58.4 76.2,17.57 R47.2
N$95
  Bottom 0.2: R46.1 Q2.3
N$96
  Bottom 0.2: R47.1 Q3.3
N$98
  Top 0.2: LED8.C R57.1
N$99
  Top 0.2: LED9.C R58.1
N$100
  Top 0.2: LED8.A 77.15,68.58 75.89,67.32 IC6.15
N$101
  Top 0.2: LED9.A 77.15,66.99 76.69,66.53 IC6.14
N$102  (via drill 0.3)
  Top 0.406: v78.42,60.33 78.89,59.85 IC6.7
  Bottom 0.406: C40.2 77.55,60.33 v78.42,60.33
N$104
  Top 0.2: U$82.3 U$82.6 46.04,20 46.04,21.59 | R_MD4.2 46.04,21.59 | 46.04,21.59 R_MD4.2
NMCLR  (via drill 0.3)
  Top 0.2: JP5.5 78.74,70.8 78.11,70.17 76.52,70.17 v75.25,68.9 | v73.34,68.9 73.5,68.73 IC6.18
  Top 0.406: R59.1 78.74,74.29 JP5.5
  Bottom 0.2: v75.25,68.9 v73.34,68.9
P22  (via drill 0.3)
  Top 0.2: S5.2 S5.1 | U$1.26 44.13,33.35 44.13,33.02 43.81,32.7 v42.86,32.7
  Bottom 0.2: 41.59,32.7 41.59,13.65 43.18,12.06 59.05,12.06 60.36,10.76 S5.1 | 41.59,32.7 41.59,35.24 42.55,36.2 R24.1 | v42.86,32.7 41.59,32.7
P23  (via drill 0.3)
  Top 0.2: S4.2 S4.1 | v40.96,36.83 42.01,35.77 U$1.25
  Bottom 0.2: R23.2 41.91,37.78 v40.96,36.83 40.96,13.02 42.55,11.43 45.09,11.43 45.76,10.76 S4.1
P24  (via drill 0.3)
  Top 0.2: S3.2 S3.1 | v40.32,36.2 41.51,35.01 U$1.24
  Bottom 0.2: R32.1 42.23,39.37 40.32,37.47 v40.32,36.2 40.32,13.02 38.42,11.11 32.38,11.11 31.79,10.52 S3.1
P25  (via drill 0.3)
  Top 0.2: S2.2 S2.1 | v39.69,35.56 41.01,34.23 U$1.23
  Bottom 0.2: R31.2 42.86,41.27 39.69,38.1 v39.69,35.56 39.69,13.34 38.1,11.75 17.46,11.75 16.55,10.83 S2.1
PA0
  Top 0.2: X3.3 32.51,56.96 U$1.70
PA1
  Top 0.2: X3.4 arc-90 33.66,58.42 33.66,56.2 33.01,55.55 U$1.69
PA2
  Top 0.2: X3.5 34.92,56.2 33.51,54.78 U$1.68
PA3
  Top 0.2: X3.6 35.24,59.69 arc-90 36.2,58.74 36.2,58.42 36.2,56.2 34.01,54.02 U$1.67
PA4
  Top 0.2: X3.7 37.47,56.2 34.51,53.24 U$1.66
PA5
  Top 0.2: X3.8 37.78,59.69 arc-90 38.73,58.74 38.73,58.42 38.73,56.2 35.01,52.48 U$1.65
PA6
  Top 0.2: X3.9 40.01,56.2 35.51,51.7 U$1.64
PA7
  Top 0.2: X3.10 40.32,59.69 arc-90 41.27,58.74 41.27,58.42 41.27,56.2 36.01,50.94 U$1.63
PC7  (via drill 0.3)
  Top 0.2: v65.41,20.32 66.99,21.91 80.96,21.91 81.92,20.95 91.12,20.95 92.71,19.37 95.57,19.37 X1.10 | v46.67,43.18 46.55,43.05 U$1.45
  Bottom 0.2: R27.2 92.39,20.64 93.66,19.37 95.57,19.37 X1.10 | v46.67,43.18 46.99,43.18 47.62,42.55 47.62,27.94 49.85,25.72 64.14,25.72 65.41,24.45 v65.41,20.32
PGEC1  (via drill 0.3)
  Top 0.2: JP5.1 68.58,70.48 70.3,68.77 IC6.22 70.21,64.77 v68.9,64.77
  Bottom 0.2: v68.9,64.77 SJ4.1
PGED1  (via drill 0.3)
  Top 0.2: IC6.21 71.12,64.88 JP5.2 71.12,73.66 70.48,74.3 68.26,74.3 65.72,71.75 65.72,47.31 68.58,44.45 68.58,40.64 70.17,39.37 75.88,39.37 77.79,37.47 83.19,37.47 85.41,35.24 v85.41,33.97 | v62.87,12.7 68.9,18.73 79.06,18.73 80.64,17.14 84.77,17.14 v85.41,17.78
  Bottom 0.2: SJ5.1 54.29,14.29 55.88,12.7 v62.87,12.7 | v85.41,17.78 v85.41,33.97
PIC_DM
  Top 0.305: X10.2 87.09,57.78 88.58,57.78 arc90 89.53,58.74 89.53,60.33 arc90 88.58,61.28 83.5,61.28 83.33,61.45 IC6.9
PIC_DP
  Top 0.2: IC6.8 80.11,60.64
  Top 0.305: 80.11,60.64 83.5,60.64 84.09,60.05 X10.3
RB9  (via drill 0.3)
  Top 0.2: IC6.1 80.01,54.97 v80.01,54.29
  Bottom 0.2: v80.01,54.29 82.87,54.29 SJ1.2
RES#  (via drill 0.3)
  Top 0.2: X1.13 92.39,13.02 91.12,14.29 91.12,17.78 89.85,19.05 v84.77,19.05 80.64,19.05 79.69,20 68.26,20 61.91,13.65 v32.07,13.65 32.07,22.23 34.51,24.67 U$1.10
  Top 0.406: S1.2 S1.1 24.17,20.92 24.45,21.27 R15.1
  Bottom 0.2: v32.07,13.65 24.41,13.65 S1.2 | SJ1.1 82.87,51.12 81.28,49.53 81.28,39.37 84.77,35.88 v84.77,19.05
RSPCKB
  Top 0.2: X8.3 18.75,61.28 21.27,61.28 22.23,60.33 22.23,54.29 25.08,51.44 29.53,51.44 31.01,49.95 U$1.73
RXD0  (via drill 0.3)
  Top 0.2: v80.96,25.08 58.42,25.08 56.52,26.99 48.26,26.99 46.04,29.21 46.04,33.66 45.64,34.05 U$1.27
  Bottom 0.2: JP3.1 86.36,3.17 82.55,6.99 82.55,7.94 82.55,13.34 80.96,14.92 80.96,16.19 v80.96,25.08
RXD1  (via drill 0.3)
  Top 0.2: JP7.6 56.83,23.5 55.24,25.08 41.59,25.08 39.51,27.16 U$1.20 | v63.5,18.73 66.04,18.73 67.94,20.64 80.33,20.64 81.28,19.68 v86.68,19.68 90.49,19.68 91.76,18.41 91.76,15.88 92.08,15.56 X1.11 | IC6.2 80.12,55.88 81.6,55.88 81.92,55.56 v84.77,55.56
  Bottom 0.2: R17.2 X1.11 | JP7.6 58.1,18.73 v63.5,18.73 | v84.77,55.56 84.77,50.8 82.55,48.58 82.55,39.37 86.68,35.24 v86.68,19.68
RXD2  (via drill 0.3)
  Top 0.2: v46.35,41.27 46.08,41.55 U$1.42
  Bottom 0.2: JP7.2 55.88,15.88 49.53,15.88 48.58,16.83 48.58,22.86 46.35,25.08 v46.35,41.27
RXD5
  Top 0.2: X5.2 arc90 53.68,53.98 | 53.68,53.98 53.66,53.98 53.68,53.98 | 53.68,53.98 50.48,53.98 44.01,47.51 U$1.50
RXD6
  Top 0.2: X7.2 arc90 53.68,62.23 | 53.68,62.23 53.66,62.23 53.68,62.23 | 53.68,62.23 50.8,62.23 42.55,53.98 40.32,53.98 37.01,50.66 U$1.61
SCL0
  Top 0.2: 47.08,37.55 U$1.34
  Top 0.305: U$32.3 77.15,37.15 75.56,38.73 48.26,38.73 47.08,37.55
  Bottom 0.305: U$32.3 R25.2
SDA0
  Top 0.2: 47.53,37.05 U$1.33
  Top 0.305: U$32.4 74.61,37.15 73.66,38.1 48.58,38.1 47.53,37.05
  Bottom 0.305: U$32.4 R26.2
SSLB0
  Top 0.2: X8.4 18.75,58.74 20.64,58.74 21.59,57.78 21.59,53.98 24.77,50.8 29.53,50.8 30.51,49.81 U$1.74
TCK  (via drill 0.3)
  Top 0.2: v57.15,24.45 55.88,25.72 41.91,25.72 40.01,27.61 U$1.21 | v63.82,24.45 82.23,24.45 83.19,23.5 88.58,23.5 93.34,28.26 X1.1
  Bottom 0.2: R8.2 X1.1 | v57.15,24.45 v63.82,24.45
TMS  (via drill 0.3)
  Top 0.2: v53.34,24.45 41.27,24.45 39.01,26.71 U$1.19 | v64.45,19.37 65.72,19.37 67.63,21.27 80.64,21.27 81.6,20.32 90.81,20.32 93.03,18.1 X1.9
  Bottom 0.2: R11.2 X1.9 | v53.34,24.45 54.93,22.86 63.5,22.86 64.45,21.91 v64.45,19.37
TRST#  (via drill 0.3)
  Top 0.2: v55.24,23.81 40.96,23.81 37.51,27.26 U$1.16 | v63.18,23.81 81.92,23.81 82.87,22.86 88.9,22.86 91.76,25.72 X1.3
  Bottom 0.2: R9.2 X1.3 | v55.24,23.81 v63.18,23.81
TXD0  (via drill 0.3)
  Top 0.2: v82.23,25.08 81.6,25.72 80.64,25.72 58.74,25.72 56.83,27.62 48.58,27.62 46.67,29.53 46.67,33.97 46.09,34.55 U$1.28
  Bottom 0.2: JP3.2 84.77,5.71 83.19,7.3 83.19,13.65 81.6,15.24 81.6,23.5 82.23,24.13 v82.23,25.08
TXD1  (via drill 0.3)
  Top 0.2: JP7.5 59.37,23.18 | 59.37,23.18 56.2,26.35 42.23,26.35 40.51,28.07 U$1.22 | 59.37,23.18 81.6,23.18 82.55,22.23 v86.04,22.23 91.76,22.23 92.71,23.18 X1.5 | 80.09,56.52 IC6.3 81.78,56.66 81.92,56.52 v82.87,56.52
  Bottom 0.2: R10.2 X1.5 | v82.87,56.52 83.5,56.52 84.14,55.88 84.14,51.12 81.92,48.9 81.92,39.37 86.04,35.24 v86.04,22.23
TXD2  (via drill 0.3)
  Top 0.2: v46.35,42.23 46.03,42.55 U$1.44
  Bottom 0.2: JP7.1 58.1,16.19 56.2,16.19 46.99,25.4 46.99,41.59 v46.35,42.23
TXD5
  Top 0.2: X5.1 50.16,52.7 46.67,49.21 46.67,45.72 46.01,45.05 U$1.49
TXD6
  Top 0.2: X7.1 50.48,60.96 42.86,53.34 40.64,53.34 38.01,50.71 U$1.59
USB0_DM  (via drill 0.3)
  Top 0.2: 47.12,38.55 U$1.36
  Top 0.305: v63.82,39.37 47.94,39.37 47.12,38.55
  Bottom 0.305: R22.2 80.33,75.25 79.69,74.61 68.26,74.61 66.99,73.34 66.99,51.75 63.82,48.58 v63.82,39.37
USB0_DP  (via drill 0.3)
  Top 0.2: 46.67,39.05 U$1.37
  Top 0.305: v61.28,40.01 47.62,40.01 46.67,39.05
  Bottom 0.305: R29.2 81.28,77.15 79.38,75.25 67.94,75.25 66.36,73.66 66.36,52.07 61.28,46.99 v61.28,40.01
VCC  (via drill 0.3)
  Top 0.2: U$17.3 54.12,77.45 C7.2 | C34.2 67.01,77.47 U$3.3
  Top 0.305: C7.2 51.75,77.47 50.8,77.47 49.85,78.42 v49.85,79.06 | v65.09,79.06 65.09,78.42 66.04,77.47 66.99,77.47 C34.2 | 36.12,70.92 36.01,70.8 34.92,70.8
  Top 0.406: v67.63,48.26 69.22,49.85 76.69,49.85 | 76.69,49.85 77.79,49.85 79.06,51.12 83.5,51.12 84.45,50.16 v84.45,47.94 | 76.69,49.85 IC6.42
  Top 0.813: v34.92,68.9 34.92,70.8 | R41.1 26.99,65.09
  Top 1.016: 29.21,70.92 U$11.VOUT 36.12,70.92 C6.2 39.37,70.99 | 29.21,70.92 U$11.SENSE | U$26.1 39.67,70.99 39.37,70.99 | SG2.1 3.17,48.82 3.17,51.44 6.67,54.93 12.7,54.93 15.24,57.47 15.24,65.41 17.78,67.94 26.99,67.94 | 26.99,67.94 28.26,67.94 29.21,68.9 29.21,70.92 | v95.25,45.72 98.74,42.23 98.74,22.54 X1.8 | C3.1 39.37,68.66 39.37,70.99 | 5V.1 v34.92,68.9 | 26.99,65.09 26.99,67.94
  Bottom 0.2: X4.4 67.63,34.98 | 67.63,43.12 X6.4 67.63,43.24
  Bottom 0.305: U$9.P$2 | U$27.P$2
  Bottom 0.406: 67.63,34.98 67.63,43.12 | D1.A 92.1,45.72 | X25.1 | 67.63,43.24 v67.63,48.26
  Bottom 0.813: 65.09,87.31 65.42,87.31
  Bottom 1.016: v84.45,47.94 86.7,45.7 D1.A | U$9.P$3 26.67,93.15 | 26.67,93.15 U$9.P$1 | U$9.P$2 26.67,93.15 | U$27.P$3 45.72,93.15 | 45.72,93.15 U$27.P$1 | 45.72,93.15 U$27.P$2 45.72,87.31 | U$4.P$1 65.42,93.15 | 65.42,93.15 U$4.P$3 | 65.42,93.15 U$4.P$2 65.42,87.31 73.34,87.31 75.25,85.41 84.47,85.41 | U$5.P$1 84.47,93.15 | 84.47,93.15 U$5.P$3 | 84.47,93.15 U$5.P$2 84.47,85.41 | v34.92,68.9 34.92,87.31 | 34.92,87.31 45.72,87.31 | 45.72,87.31 49.85,87.31 | 49.85,87.31 65.09,87.31 v65.09,79.06 | 84.47,85.41 91.76,85.41 95.25,81.92 95.25,72.71 | 95.25,72.71 95.25,55.56 | 95.25,55.56 v95.25,45.72 92.1,45.72 | U$76.2 95.25,55.56 | X25.1 95.25,72.71 | 34.92,87.31 28.26,87.31 26.68,88.89 U$9.P$2 | v49.85,79.06 49.85,87.31
VIN1
  Bottom 1.27: S6.2 6.67,60.33 7.62,61.28 13.02,61.28 14.92,63.18 14.92,66.36 13.79,67.48 J1.3 13.79,73.83 12.06,75.56 8.26,75.56 6.35,77.47 U$10.P$1
VIN2
  Top 1.27: JP4.1 16.51,83.82 18.73,86.04 29.53,86.04 31.57,84 U$11.VIN@1 32.59,81.1 U$11.VIN@0
  Bottom 1.27: 3.81,64.32 C4.2 4,63.95 4.13,63.82 3.81,63.5 3.81,59.05 S6.1 4.13,57.47 5.71,55.88 12.38,55.88 16.83,60.33 16.83,73.66 12.7,77.79 12.7,80.33 14.29,81.92 JP4.1
XCIN
  Top 0.2: U$1.8 33.51,24.94 30.48,21.91 27.3,21.91 26.67,21.27 26.67,19.88 U$12.1 26.48,17.82 C9.1
XCOUT
  Top 0.2: U$1.9 34.01,24.8 30.8,21.59 30.8,19.81 U$12.2 30.68,17.82 C10.1
XTAL
  Top 0.2: C5.2 34.29,17.14 33.77,17.66 U$61.3 33.67,18.73 33.02,18.73 32.7,19.05 32.7,22.23 35.01,24.54 U$1.11

## Text on the board
tPlace: - | CAN0 | CAN1 | + | DC12V | NITROBOCONSTUDIO | NHK2016Mother_rev3 | BOOT | BT | RESET | USB | SW0 | SW1 | SW2 | SW3